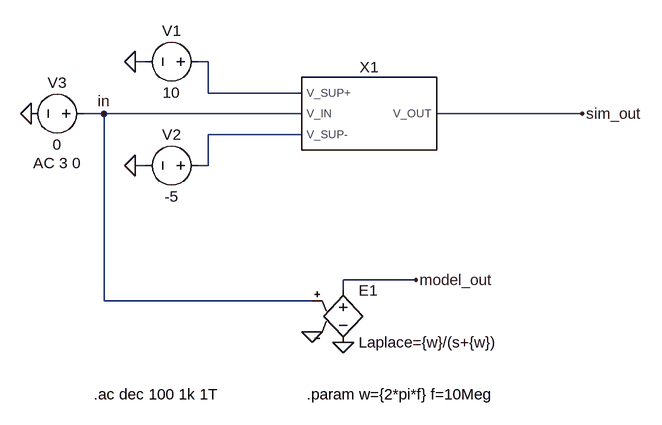
[diagram p0: schematic sim_power-electronics_ac.asc]
sim_power-electronics_ac.asc, the LTspice schematic file:
Version 4
SHEET 1 880 680
WIRE -64 80 -80 80
WIRE 32 80 16 80
WIRE 32 128 32 80
WIRE 176 128 32 128
WIRE -128 160 -160 160
WIRE 176 160 -128 160
WIRE 608 160 384 160
WIRE 176 192 32 192
WIRE -64 240 -80 240
WIRE 32 240 32 192
WIRE 32 240 16 240
WIRE 352 416 240 416
WIRE 240 432 240 416
WIRE -128 448 -128 160
WIRE 192 448 -128 448
FLAG -80 240 0
FLAG -80 80 0
FLAG -240 160 0
FLAG 192 496 0
FLAG 240 512 0
FLAG 352 416 model_out
FLAG 608 160 sim_out
FLAG -128 160 in
SYMBOL voltage 32 80 R90
WINDOW 0 -32 56 VBottom 2
WINDOW 3 32 56 VTop 2
WINDOW 123 0 0 Left 0
WINDOW 39 0 0 Left 0
SYMATTR InstName V1
SYMATTR Value 10
SYMBOL voltage 32 240 R90
WINDOW 0 -32 56 VBottom 2
WINDOW 3 32 56 VTop 2
WINDOW 123 0 0 Left 0
WINDOW 39 0 0 Left 0
SYMATTR InstName V2
SYMATTR Value -5
SYMBOL voltage -144 160 R90
WINDOW 0 -32 56 VBottom 2
WINDOW 3 32 56 VTop 2
WINDOW 123 60 56 VTop 2
WINDOW 39 0 0 Left 0
SYMATTR InstName V3
SYMATTR Value 0
SYMATTR Value2 AC 3 0
SYMBOL e 240 416 R0
SYMATTR InstName E1
SYMATTR Value Laplace={w}/(s+{w})
SYMBOL power-electronics 272 160 R0
SYMATTR InstName X1
TEXT -144 592 Left 2 !.ac dec 100 1k 1T
TEXT 184 592 Left 2 !.param w={2*pi*f} f=10Meg

The netlist it stands for:
* sim_power-electronics_ac.asc
V1 N001 0 10
V2 N002 0 -5
V3 in 0 0 AC 3 0
E1 model_out 0 in 0 Laplace={w}/(s+{w})
XX1 in N001 N002 sim_out power-electronics  ; pins V_IN V_SUP+ V_SUP- V_OUT
.ac dec 100 1k 1T
.param w={2*pi*f} f=10Meg
.backanno
.end